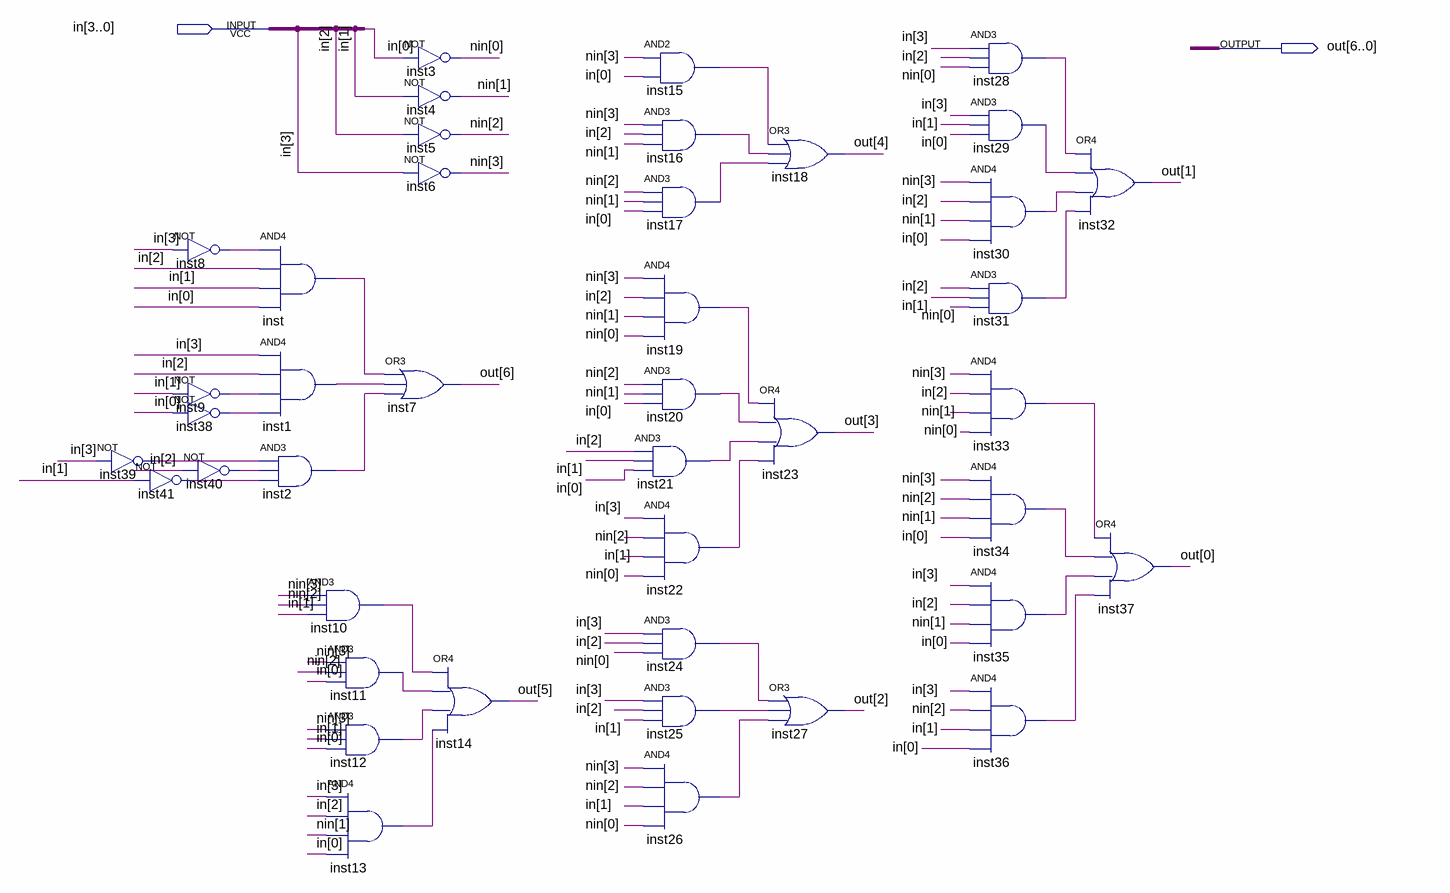
[diagram p0: schematic sheet]
// Quartus schematic 7_Segment_Decoder.bdf as structural Verilog: 42 symbols, 2 pins
module \7_Segment_Decoder  (
  input  [3:0] in,
  output [6:0] out
);

  wire inst1_out, inst2_out, inst8_out, inst9_out, inst10_out, inst11_out, inst12_out, inst13_out,
       inst15_out, inst16_out, inst17_out, inst19_out, inst20_out, inst21_out, inst22_out, inst24_out,
       inst25_out, inst26_out, inst28_out, inst29_out, inst30_out, inst31_out, inst33_out, inst34_out,
       inst35_out, inst36_out, inst38_out, inst39_out, inst40_out, inst41_out, inst_out;
  wire [3:0] nin;

  not inst39 (inst39_out, in[3]);
  not inst8 (inst8_out, in[3]);
  not inst9 (inst9_out, in[1]);
  not inst38 (inst38_out, in[0]);
  not inst40 (inst40_out, in[2]);
  not inst41 (inst41_out, in[1]);
  and inst (inst_out, inst8_out, in[2], in[1], in[0]);
  and inst1 (inst1_out, in[3], in[2], inst9_out, inst38_out);
  and inst2 (inst2_out, inst39_out, inst40_out, inst41_out);
  and inst10 (inst10_out, nin[3], nin[2], in[1]);
  and inst11 (inst11_out, nin[3], nin[2], in[0]);
  and inst12 (inst12_out, nin[3], in[1], in[0]);
  and inst13 (inst13_out, in[3], in[2], nin[1], in[0]);
  not inst3 (nin[0], in[0]);
  not inst4 (nin[1], in[1]);
  not inst5 (nin[2], in[2]);
  not inst6 (nin[3], in[3]);
  or inst7 (out[6], inst_out, inst1_out, inst2_out);
  or inst14 (out[5], inst10_out, inst11_out, inst12_out, inst13_out);
  and inst15 (inst15_out, nin[3], in[0]);
  and inst16 (inst16_out, nin[3], in[2], nin[1]);
  and inst17 (inst17_out, nin[2], nin[1], in[0]);
  and inst19 (inst19_out, nin[3], in[2], nin[1], nin[0]);
  and inst20 (inst20_out, nin[2], nin[1], in[0]);
  and inst21 (inst21_out, in[2], in[1], in[0]);
  and inst22 (inst22_out, in[3], nin[2], in[1], nin[0]);
  and inst24 (inst24_out, in[3], in[2], nin[0]);
  and inst25 (inst25_out, in[3], in[2], in[1]);
  and inst26 (inst26_out, nin[3], nin[2], in[1], nin[0]);
  or inst18 (out[4], inst15_out, inst16_out, inst17_out);
  or inst23 (out[3], inst19_out, inst20_out, inst21_out, inst22_out);
  or inst27 (out[2], inst24_out, inst25_out, inst26_out);
  and inst28 (inst28_out, in[3], in[2], nin[0]);
  and inst29 (inst29_out, in[3], in[1], in[0]);
  and inst30 (inst30_out, nin[3], in[2], nin[1], in[0]);
  and inst31 (inst31_out, in[2], in[1], nin[0]);
  and inst33 (inst33_out, nin[3], in[2], nin[1], nin[0]);
  and inst34 (inst34_out, nin[3], nin[2], nin[1], in[0]);
  and inst35 (inst35_out, in[3], in[2], nin[1], in[0]);
  and inst36 (inst36_out, in[3], nin[2], in[1], in[0]);
  or inst32 (out[1], inst28_out, inst29_out, inst30_out, inst31_out);
  or inst37 (out[0], inst33_out, inst34_out, inst35_out, inst36_out);
endmodule
